# EAGLE design PWM_LuefterRegler (EAGLE 6.4)
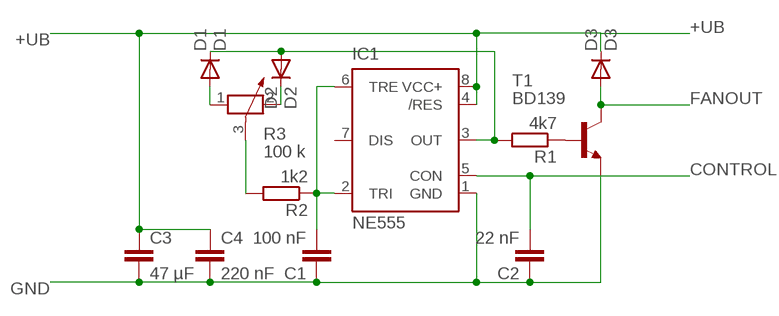
[diagram p0: schematic, sheet 1]

## Parts
C1  100 nF  C2,5-3  [C2.5-3]
C2  22 nF  C7.5/3  [C7.5B3]
C3  47 µF  C5/4.5  [C5B4.5]
C4  220 nF  C7.5/3  [C7.5B3]
D1  D1  1N4148DO35-10  [DO35-10]
D2  D2  1N4148DO35-10  [DO35-10]
D3  D3  1N4148DO35-10  [DO35-10]
IC1  NE555  [DIL-08]
R1  4k7  R-EU_0207/10  [0207/10]
R2  1k2  R-EU_0207/10  [0207/10]
R3  100 k  POTENTIOMETER_PT-10  [PT-10]
T1  BD139  [TO126]

## Nets
+UB: C3.1 C4.1 D3.C IC1.4(/RES) IC1.8(VCC+)
CONTROL: C2.2 IC1.5(CON)
FANOUT: D3.A T1.2(C)
GND: C1.1 C2.1 C3.2 C4.2 IC1.1(GND) T1.1(E)
N$1: C1.2 IC1.2(TRI) IC1.6(TRE) R2.1
N$2: D2.C R3.2
N$3: R2.2 R3.3
N$4: D1.A R3.1
N$5: D1.C D2.A IC1.3(OUT) R1.2
N$7: R1.1 T1.3(B)
Unconnected: IC1.7(DIS)

## Library data of the parts
C1-C4 = capacitor-wima:C: CAPACITOR naming: grid - package width
D1-D3 = diode:1N4148: DIODE high speed (Philips)
IC1 = st-microelectronics:NE555: General purpose bipolar Timer; MF: Arrow Electronics; MPN: NE555N; OC_FARNELL: 1467742; OC_NEWARK: 89K1486
R1 R2 = rcl:R-EU_: RESISTOR, European symbol
R3 = rcl:POTENTIOMETER_: Potentiometer
T1 = transistor:BD139: NPN TRANSISTOR

## Board
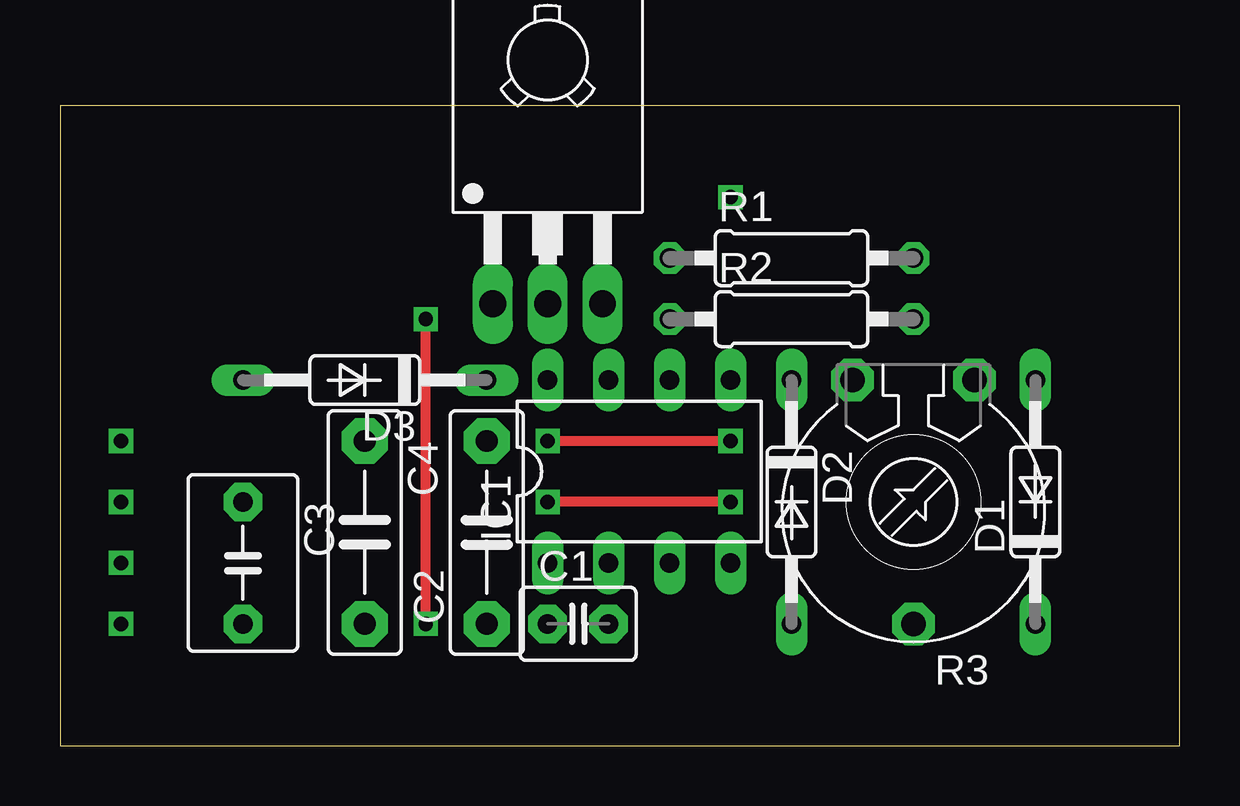
[diagram p1: board, top side]
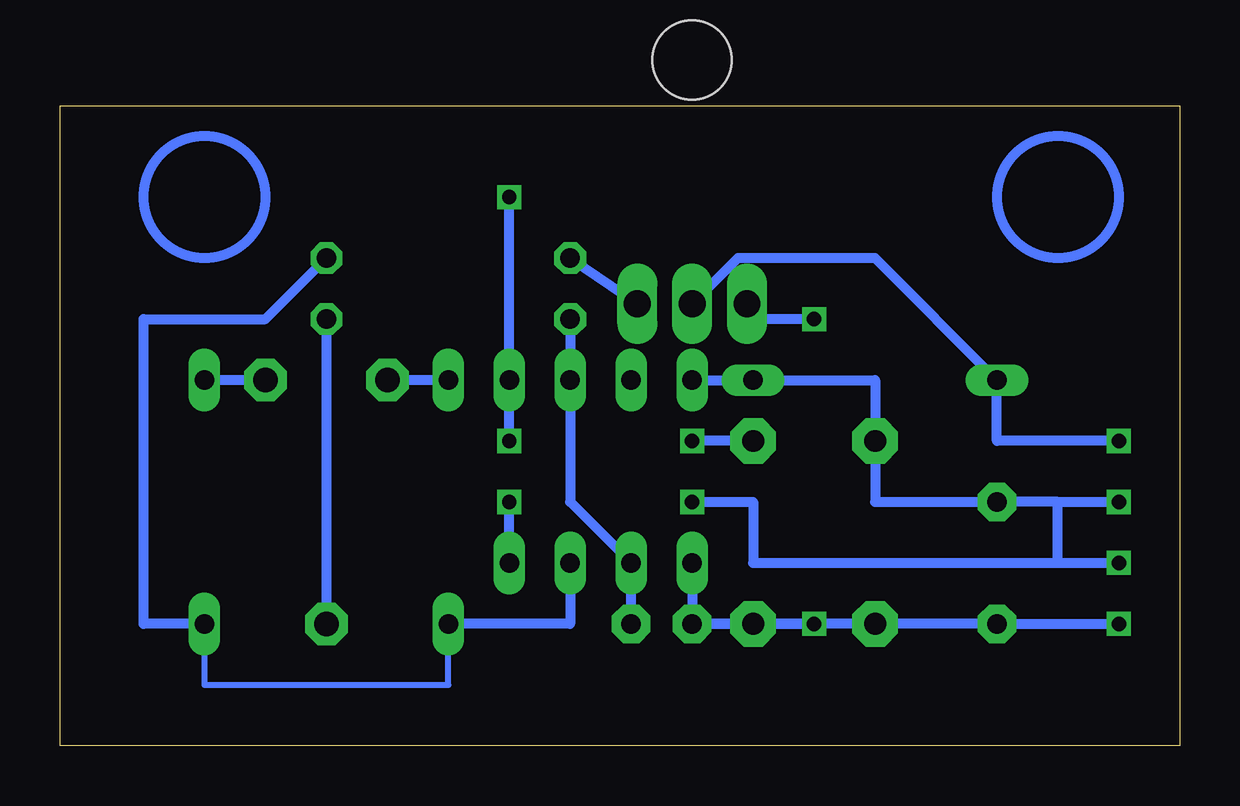
[diagram p2: board, bottom side, seen from below]

Size 46.66 x 26.66 mm. Coordinates in mm from the lower left corner, seen from the top.
Outline: 0,0 46.66,0 46.66,26.66 0,26.66 0,0
Copper layers (1*16): Top 0.035mm / dielectric 1.5mm / Bottom 0.035mm
Design rules "default": minimum track width 10mil, minimum drill 24mil, track to track 8mil, track to pad 8mil, pad to pad 8mil, via to via 8mil, smd to smd 8mil, copper to edge 40mil, drill to drill 8mil, minimum pad ring 10mil, minimum via ring 8mil, stop-mask expansion 4mil, vias tented up to drill 0mil, thermal gap 10mil

### Footprints (pad centres in the part's own frame; a part is rotated, then mirrored left to right if it is on the bottom)
C2.5-3 = drill 0.813 pad 1.6 octagon: 1 -1.27,0; 2 1.27,0
C7.5B3 = drill 0.914 pad 1.905 octagon: 1 -3.81,0; 2 3.81,0
C5B4.5 = drill 0.813 pad 1.6 octagon: 1 -2.54,0; 2 2.54,0
DO35-10 = drill 0.813 long: A 5.08,0; C -5.08,0
DIL-08 = drill 0.813 long: 1 -3.81,-3.81; 2 -1.27,-3.81; 3 1.27,-3.81; 4 3.81,-3.81; 5 3.81,3.81; 6 1.27,3.81; 7 -1.27,3.81; 8 -3.81,3.81
0207/10 = drill 0.813 octagon: 1 -5.08,0; 2 5.08,0
PT-10 = drill 1.016 pad 1.778 octagon: 1 -2.54,-5.08; 2 2.54,-5.08; 3 0,5.08
TO126 = drill 1.118 long: 1 -2.286,-5.08; 2 0,-5.08; 3 2.286,-5.08 | hole 3.302: 0,5.08

### Placement (x,y rotation side)
C1  21.59,5.08 0 top
C2  17.78,8.89 90 top
C3  7.62,7.62 270 top
C4  12.7,8.89 270 top
D1  40.64,10.16 90 top
D2  30.48,10.16 270 top
D3  12.7,15.24 180 top
IC1  24.13,11.43 0 top
R1  30.48,20.32 0 top
R2  30.48,17.78 0 top
R3  35.56,10.16 180 top
T1  20.32,23.49 0 top

### Tracks (layer width: path | path; a pad name or v marks a point on that pad's centre or on a via)
+UB  (via drill 0.6)
  Top 0.406: v27.94,10.16 v20.32,10.16
  Bottom 0.406: IC1.4 v27.94,10.16 | v20.32,10.16 17.78,10.16 17.78,7.62 5.08,7.62 | 5.08,7.62 5.08,10.16 | 5.08,10.16 C3.1 12.7,10.16 C4.1 12.7,15.24 D3.C IC1.8 | 5.08,10.16 v2.54,10.16 | 5.08,7.62 v2.54,7.62
CONTROL  (via drill 0.6)
  Top 0.406: v20.32,12.7 v27.94,12.7
  Bottom 0.406: C2.2 v20.32,12.7 | v27.94,12.7 IC1.5 v27.94,22.86
FANOUT  (via drill 0.6)
  Bottom 0.406: v2.54,12.7 7.62,12.7 D3.A 12.7,20.32 18.41,20.32 T1.2
GND  (via drill 0.6)
  Top 0.406: v15.24,5.08 v15.24,17.78
  Bottom 0.406: C1.1 C2.1 C4.2 C3.2 v2.54,5.08 | IC1.1 C1.1 | C1.1 v15.24,5.08 | v15.24,17.78 18.03,17.78 T1.1
N$1
  Bottom 0.406: R2.1 IC1.6 25.4,10.16 IC1.2 C1.2
N$2
  Bottom 0.406: D2.C R3.2
N$3
  Bottom 0.406: R2.2 R3.3
N$4
  Bottom 0.406: R3.1 D1.A
N$5
  Bottom 0.254: D2.A 30.48,2.54 40.64,2.54 D1.C
  Bottom 0.406: IC1.3 25.4,5.08 D2.A | D1.C 43.18,5.08 43.18,17.78 38.1,17.78 R1.2
N$7
  Bottom 0.406: R1.1 T1.3
(copper drawn outside any net)
  shapes: Bottom circle x2